# EAGLE design utilidong-septic-sepic-lt1610-mk-1.2 (EAGLE 6.5.0)
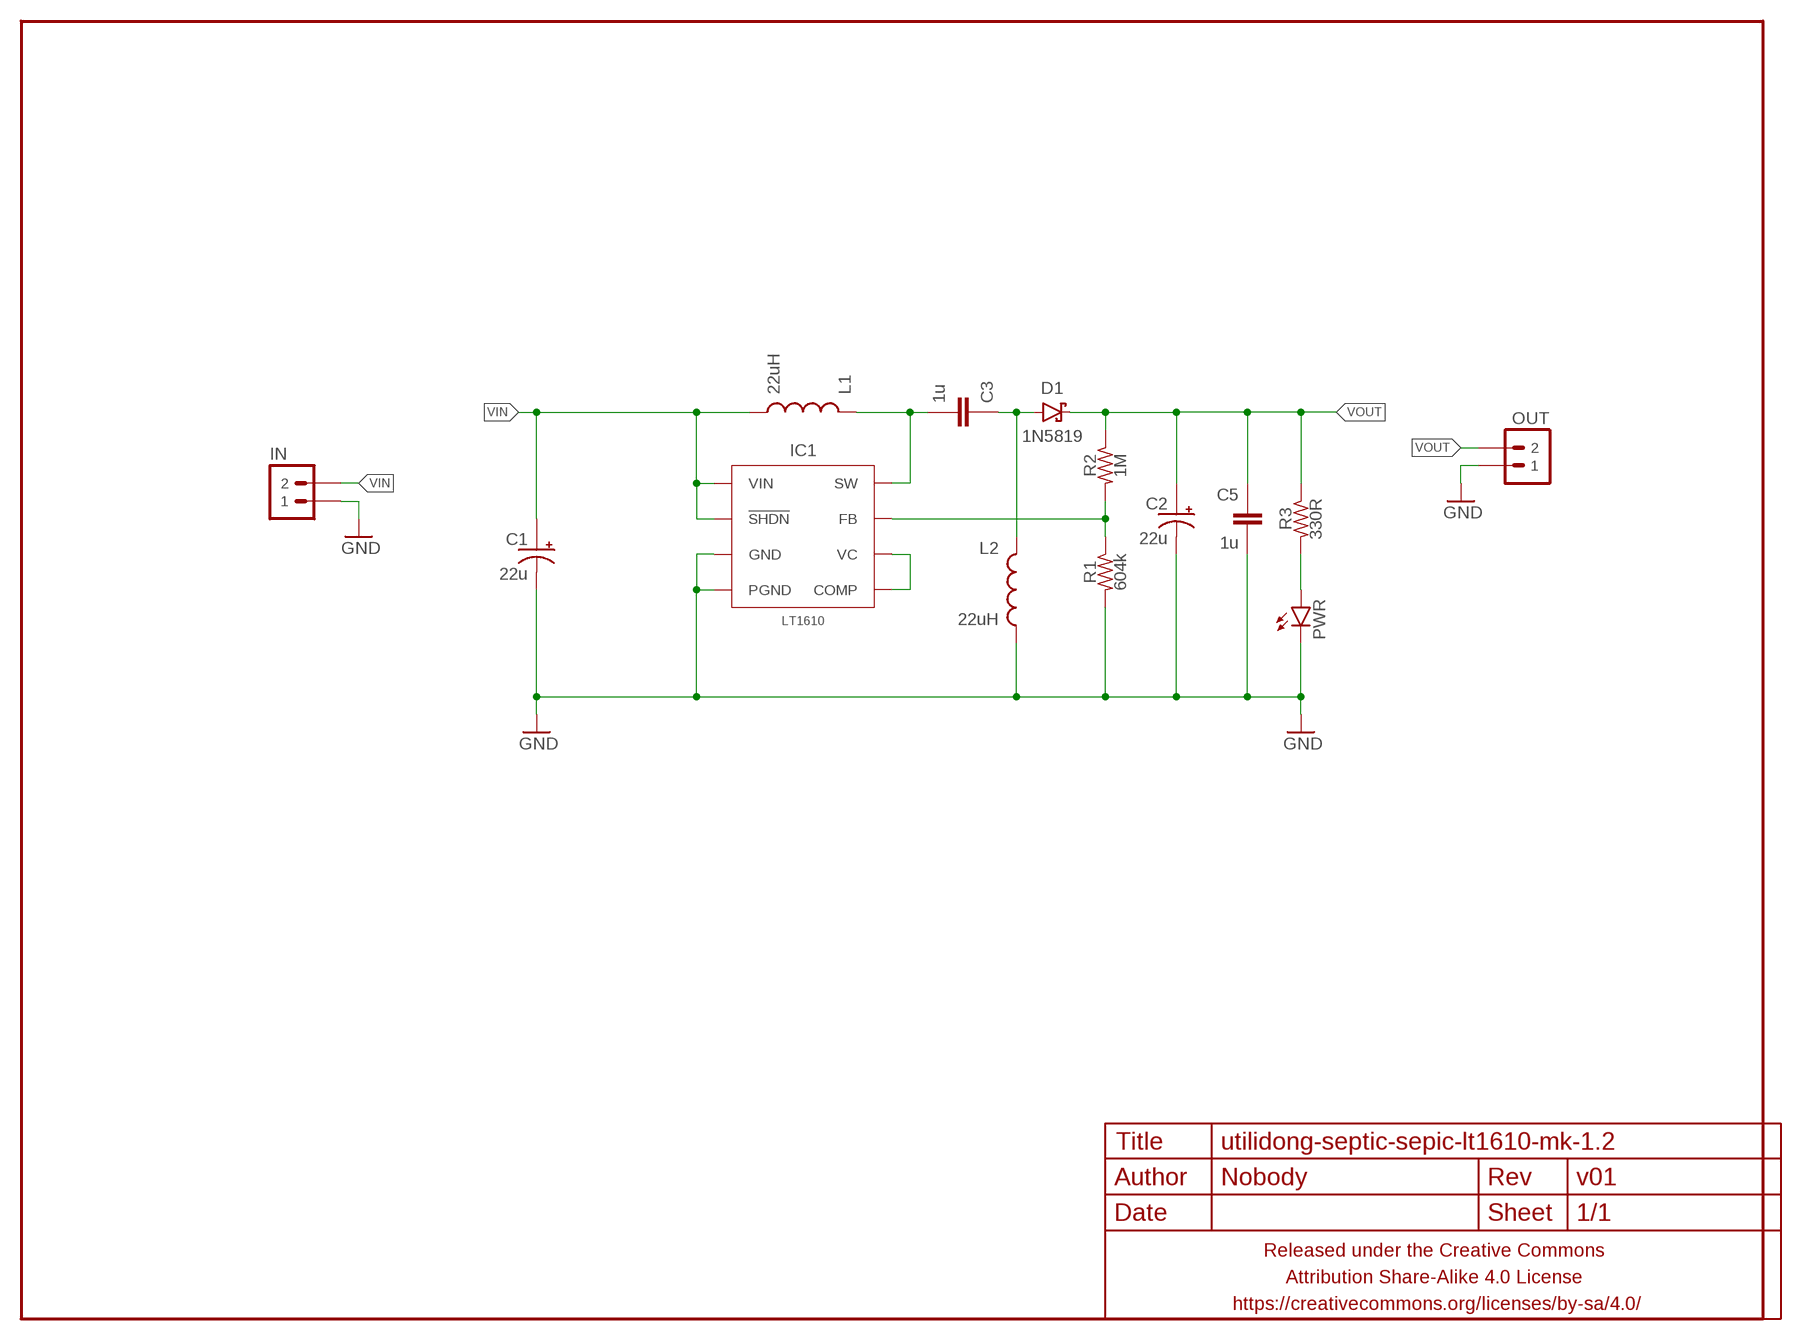
[diagram p0: schematic, sheet 1]

## Parts
C1  22u  CAPACITOR-POLARIZEDE2.5-6  [E2,5-6]
C2  22u  CAPACITOR-POLARIZEDE2.5-6  [E2,5-6]
C3  1u  CAPACITOR-CERAMIC025-024X044  [C025-024X044]
C5  1u  CAPACITOR-CERAMIC025-024X044  [C025-024X044]
D1  1N5819  DIODE-SCHOTTKYPTH-7.62MM  [DIODE-7.62MM]
FRAME1  FRAME-LETTERNO_PACKAGE  [DUMMY]
IC1  LT1610  LT1610SOICN8  [SO08]
IN  M02PTH-CENTERED-R+  [1X02-CENTER-R+]
L1  22uH  INDUCTORMURATA-1100R  [MURATA-1100R]
L2  22uH  INDUCTORMURATA-1100R  [MURATA-1100R]
OUT  M02PTH-CENTERED-R+  [1X02-CENTER-R+]
PWR  LED3MM-LESS  [LED3MM-LESSSILK]
R1  604k  RESISTORPTH-AXIAL-5.08MM  [RESISTOR-AXIAL-PTH-5.08MM]
R2  1M  RESISTORPTH-AXIAL-5.08MM  [RESISTOR-AXIAL-PTH-5.08MM]
R3  330R  RESISTORPTH-AXIAL-5.08MM  [RESISTOR-AXIAL-PTH-5.08MM]

## Nets
GND: C1.- C2.- C5.2 IC1.4(PGND) IC1.7(GND) IN.1 L2.P$2 OUT.1 PWR.K(C) R1.P$2
N$1: PWR.A R3.P$2
N$2: C3.2 IC1.5(SW) L1.P$1
N$4: IC1.1(VC) IC1.8(COMP)
N$5: C3.1 D1.A L2.P$1
N$7: IC1.2(FB) R1.P$1 R2.P$2
VIN: C1.+ IC1.3(!SHDN) IC1.6(VIN) IN.2 L1.P$2
VOUT: C2.+ C5.1 D1.K(C) OUT.2 R2.P$1 R3.P$1

## Library data of the parts
C1 C2 = A_butts:CAPACITOR-POLARIZED: POLARIZED CAPACITOR, American symbol
C3 C5 = A_butts:CAPACITOR-CERAMIC: CAPACITOR, European symbol
D1 = A_butts:DIODE-SCHOTTKY: Schottky diodes in SFE's production catalog BAT20J 1A 23V 0.62Vf RB751 120mA 40V 0.37Vf PMEG4005EJ 0.5A 40V 0.42Vf MBRA140 1A 40V 0.5Vf B340A 3A 40V SMA
FRAME1 = A_butts:FRAME-LETTER: Schematic Frame Standard 8.5x11 US Letter frame; DESIGNER: Nobody; VERSION: v01
IC1 = A_butts:LT1610
IN OUT = A_butts:M02: Standard 2-pin 0.1" header. Use with - straight break away headers ( PRT-00116) - right angle break away headers (PRT-00553) - swiss pins (PRT-00743) - machine pins (PRT-00117) - female headers (PRT-00115) Molex polarized connector foot print use with: PRT-08233 with associated crimp pins and housings. 2.54_SCREWTERM for use with PRT-10571. 3.5mm Screw Terminal footprints for PRT-08084 5mm Screw Terminal footprints for use with PRT-08433
L1 L2 = A_butts:INDUCTOR: Inductors Basic Inductor/Choke - 0603 and 1206. Footprints are not proven and vary greatly between part numbers. SRN6045- 33uH, 20% 1.4A SDR0403-560KL - 56uH, 10%, 500mA RMS/740mA peak
PWR = A_butts:LED: LEDs Standard schematic elements and footprints for 5mm, 3mm, 1206, and 0603 sized LEDs. 5mm - Spark Fun Electronics SKU : COM-00529 (and others)
R1-R3 = A_butts:RESISTOR: RESISTOR, American symbol

## Board
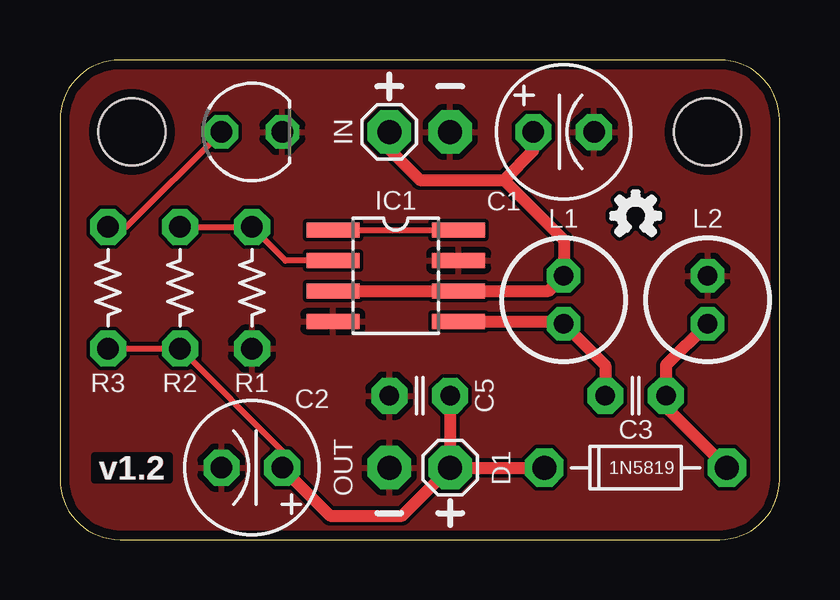
[diagram p1: board, top side]
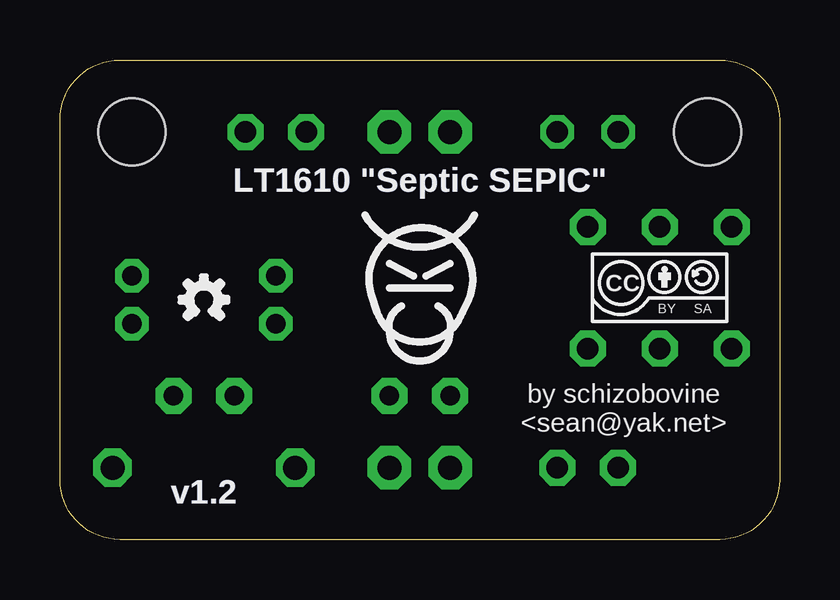
[diagram p2: board, bottom side, seen from below]

Size 30 x 20 mm. Coordinates in mm from the lower left corner, seen from the top.
Outline: 0,17.5 0,2.5 arc90 2.5,0 27.5,0 arc90 30,2.5 30,17.5 arc90 27.5,20 2.5,20 arc90 0,17.5
Copper layers (1*16): Top 0.0356mm / dielectric 1.5011mm / Bottom 0.0356mm
Design rules "LaenPCBOrder_2": minimum track width 6mil, minimum drill 13mil, track to track 6mil, track to pad 6mil, pad to pad 6mil, via to via 6mil, smd to smd 6mil, copper to edge 15mil, drill to drill 6mil, minimum pad ring 7mil, minimum via ring 7mil, stop-mask expansion 3mil, vias tented up to drill 20mil, thermal gap 10mil
Holes 2.8 mm at 3,17 27,17

### Footprints (pad centres in the part's own frame; a part is rotated, then mirrored left to right if it is on the bottom)
E2,5-6 = drill 0.9 pad 1.5 octagon: + -1.27,0; - 1.27,0
C025-024X044 = drill 0.813 pad 1.5 octagon: 1 -1.27,0; 2 1.27,0
DIODE-7.62MM = drill 1 pad 1.6 octagon: A -3.81,0; K 3.81,0
SO08 = smd 0.61 x 2.21: 1 -1.905,-2.616; 2 -0.635,-2.616; 3 0.635,-2.616; 4 1.905,-2.616; 5 1.905,2.616; 6 0.635,2.616; 7 -0.635,2.616; 8 -1.905,2.616
1X02-CENTER-R+ = drill 1 pad 1.8 octagon: 1 -1.27,0; 2 1.27,0
MURATA-1100R = drill 0.8 pad 1.4 octagon: P$1 -1,0; P$2 1,0
LED3MM-LESSSILK = drill 0.9 pad 1.4 octagon: A -1.27,0; K 1.27,0
RESISTOR-AXIAL-PTH-5.08MM = drill 0.9 pad 1.5 octagon: P$1 -2.54,0; P$2 2.54,0

### Placement (x,y rotation side)
C1  21,17 0 top
C2  8,3 180 top
C3  24,6 180 top
C5  15,6 180 top
D1  24,3 180 top
FRAME1  0,0 0 top
IC1  14,11 270 top
IN  15,17 180 top
L1  21,10 90 top
L2  27,10 90 top
OUT  15,3 0 top
PWR  8,17 0 top
R1  8,10.5 270 top
R2  5,10.5 90 top
R3  2,10.5 90 top
U$1  [CC-BY-SA-4.0-NO-URL]  5,10.5 0 bottom
U$2  [COW_SMALL_METAL_NOTEXT]  15,11 0 bottom
U$3  [OSHWLOGO_MINI]  24,10 0 bottom
U$4  [OSHWLOGO_MINI]  24,13.5 0 top

### Tracks (layer width: path | path; a pad name or v marks a point on that pad's centre or on a via)
GND
  pour Top: -0.1,-0.1 -0.1,20.1 30.1,20.1 30.1,-0.1
N$1
  Top 0.25: R3.P$2 2.77,13.04 PWR.A
N$2
  Top 0.5: IC1.5 20.91,9.1 L1.P$1 22.73,7.27 C3.2
N$4
  Top 0.25: IC1.1 IC1.8
N$5
  Top 0.5: L2.P$1 25.27,7.27 C3.1 25.27,5.54 D1.A
N$7
  Top 0.25: IC1.2 9.4,11.63 R1.P$1 R2.P$2
VIN
  Top 0.5: IC1.3 IC1.6 20.36,10.37 L1.P$2 21,12.5 18.5,15 | IN.2 13.73,16.27 15,15 18.5,15 | C1.+ 19.73,16.23 18.5,15
VOUT
  Top 0.25: R3.P$1 R2.P$1 9.27,3.69 C2.+
  Top 0.5: OUT.2 D1.K | C2.+ 11.27,1 14.27,1 OUT.2 | C5.1 OUT.2

### Text on the board
Bottom: LT1610 "Septic SEPIC"
bPlace: Switcharoo PSU | LT1610 "Septic SEPIC" | by schizobovine / <sean@yak.net>